# EAGLE design pwm_module (EAGLE 7.6.0)
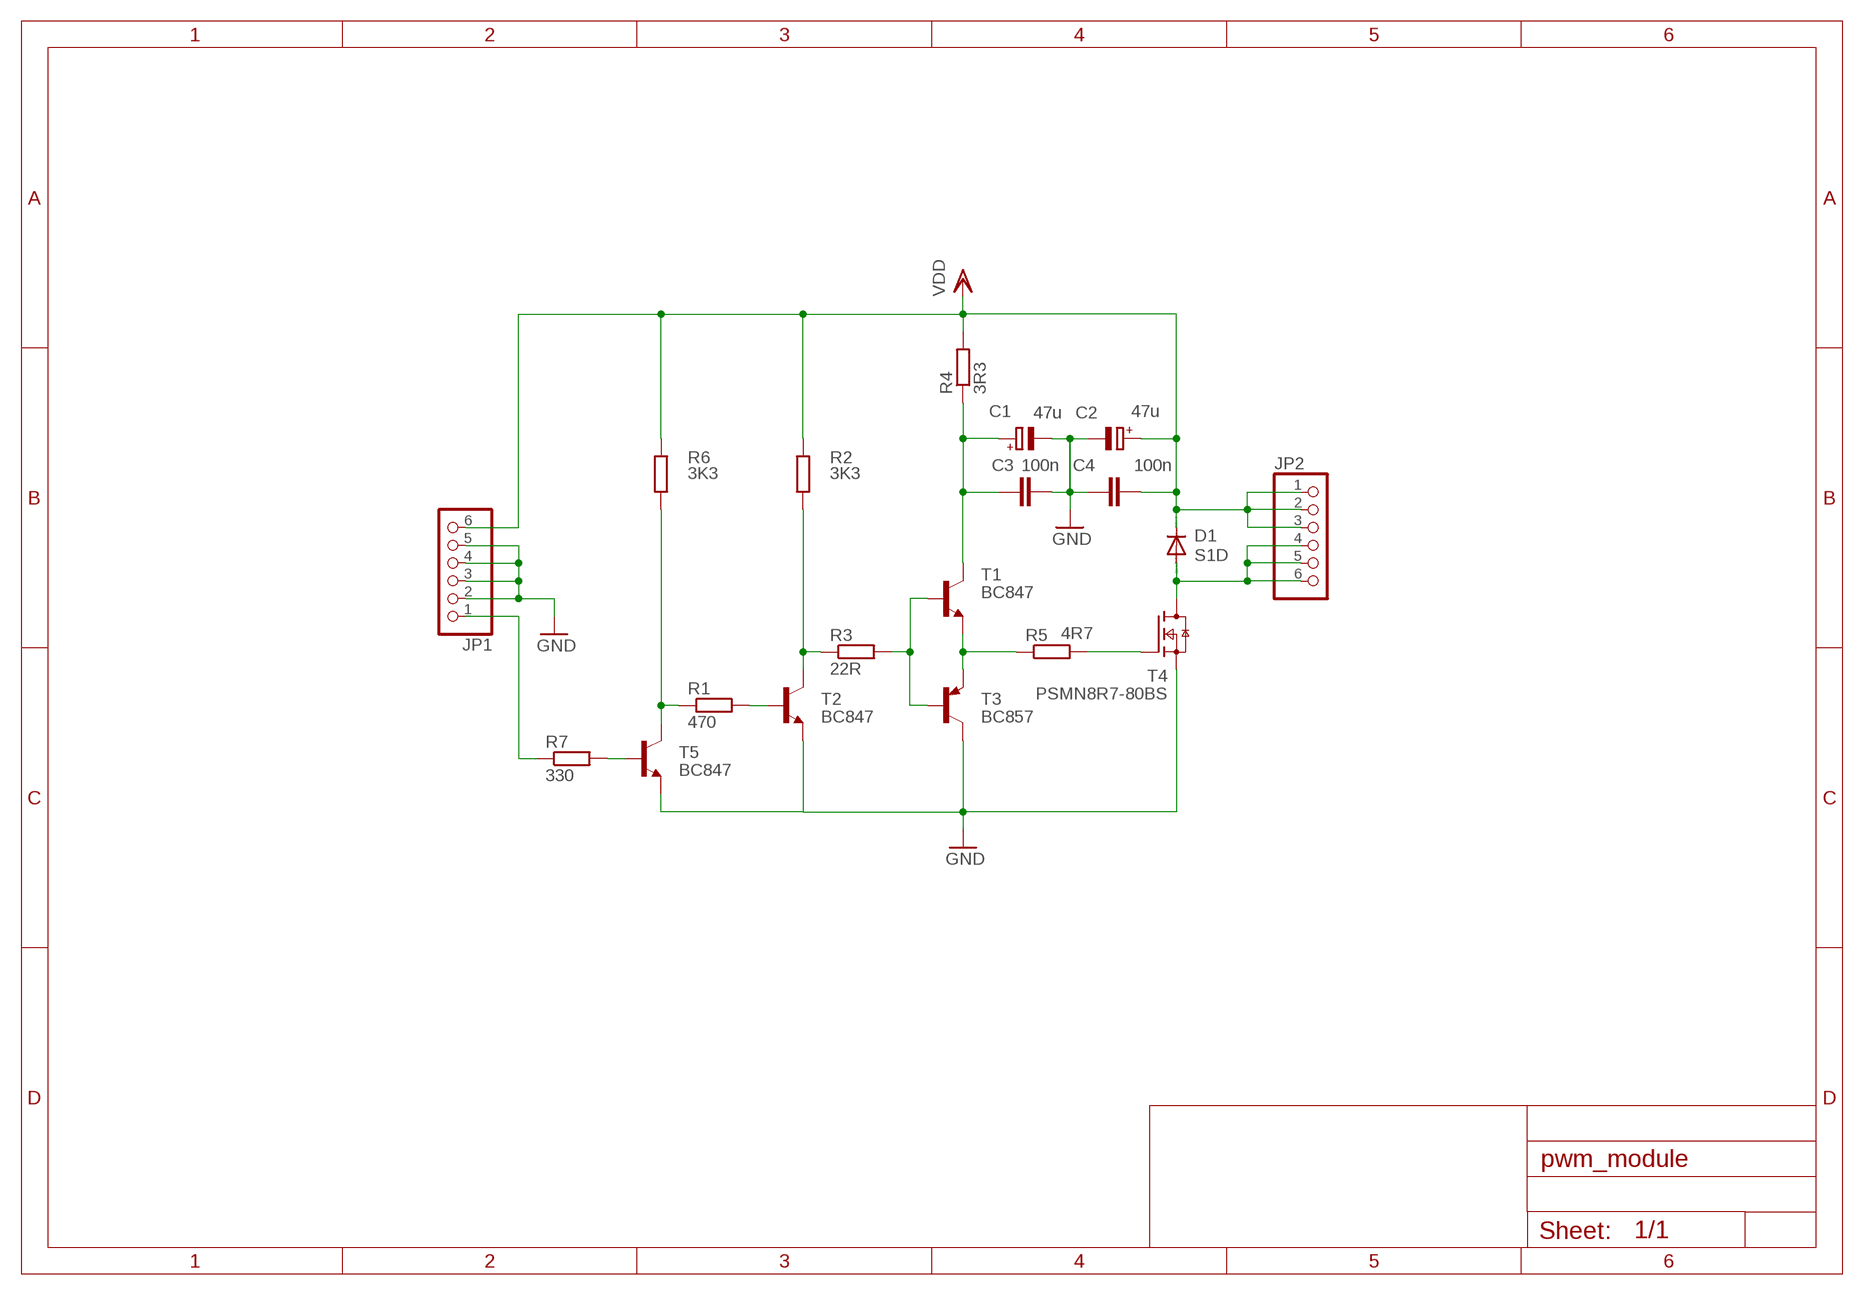
[diagram p0: schematic, sheet 1]

## Parts
C1  47u  CPOL-EUF  [PANASONIC_F]
C2  47u  CPOL-EUF  [PANASONIC_F]
C3  100n  C-EUC1206K  [C1206K]
C4  100n  C-EUC1206K  [C1206K]
D1  S1D  DIODE-DO-214AC  [DO-214AC]
JP1  PINHD-1X6  [1X06]
JP2  PINHD-1X6  [1X06]
R1  470  R-EU_M0805  [M0805]
R2  3K3  R-EU_M0805  [M0805]
R3  22R  R-EU_M0805  [M0805]
R4  3R3  R-EU_M0805  [M0805]
R5  4R7  R-EU_M0805  [M0805]
R6  3K3  R-EU_M0805  [M0805]
R7  330  R-EU_M0805  [M0805]
T1  BC847  [SOT23]
T2  BC847  [SOT23]
T3  BC857  BC857A-PNP-SOT23-BEC  [SOT23-BEC]
T4  PSMN8R7-80BS  BUK761R3-30E  [SOT404]
T5  BC847  [SOT23]

## Nets
GND: C1.- C2.- C3.2 C4.2 JP1.2 JP1.3 JP1.4 JP1.5 T2.2(E) T3.C T4.3(S) T5.2(E)
N$1: R5.1 T1.2(E) T3.E
N$2: R5.2 T4.1(G)
N$3: R3.2 T1.1(B) T3.B
N$4: R2.1 R3.1 T2.3(C)
N$5: R1.2 T2.1(B)
N$6: JP1.1 R7.1
N$7: D1.A JP2.4 JP2.5 JP2.6 T4.MB(D)
N$8: C1.+ C3.1 R4.1 T1.3(C)
N$9: R1.1 R6.1 T5.3(C)
N$10: R7.2 T5.1(B)
V+: C2.+ C4.1 D1.C JP1.6 JP2.1 JP2.2 JP2.3 R2.2 R4.2 R6.2 ; supply symbol labelled VDD

## Library data of the parts
C1 C2 = rcl:CPOL-EU: POLARIZED CAPACITOR, European symbol; FARNELL: 9696032; PRICE: 0.948
C3 C4 = rcl:C-EU: CAPACITOR, European symbol; FARNELL: 1759366; PRICE: 0.0445
D1 = diode:DIODE-: DIODE; FARNELL: 2454091; PRICE: 0.0714
JP1 JP2 = pinhead:PINHD-1X6: PIN HEADER
R1-R7 = rcl:R-EU_: RESISTOR, European symbol
T1 T2 T5 = transistor:BC847: NPN TRANSISTOR; FARNELL: 2432696; PRICE: 0.0329
T3 = transistor:*-PNP-: PNP Transistror; FARNELL: 8734771; PRICE: 0.025
T4 = nxp_60:BUK761R3-30E: N-channel TrenchMOS standard level FET Standard level N-channel MOSFET in a SOT404 package using TrenchMOS technology. This product has been designed and qualified to AEC Q101 standard for use in high performance automotive applications. AAL Eindhoven MK; FARNELL: 2112547; PRICE: 0.59

## Board
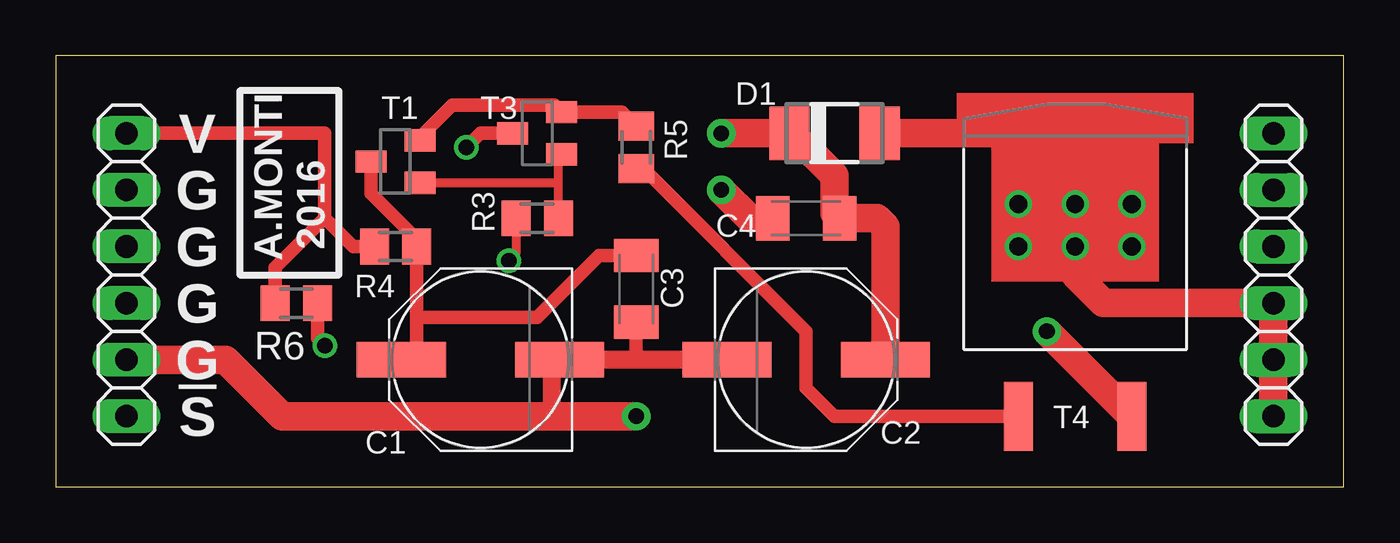
[diagram p1: board, top side]
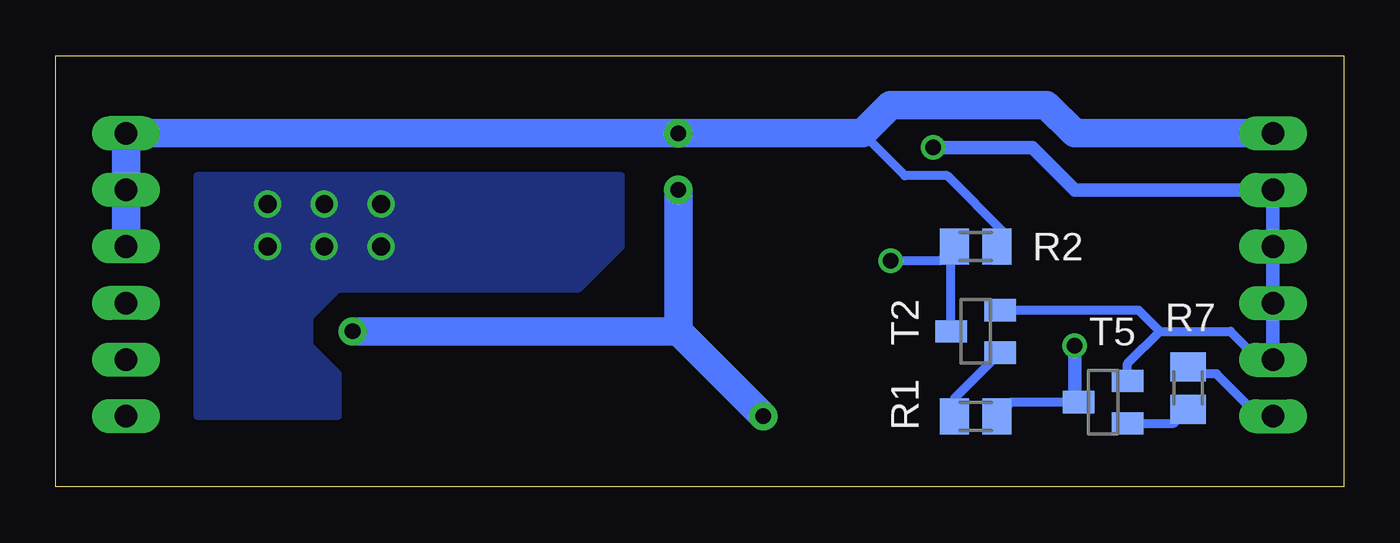
[diagram p2: board, bottom side, seen from below]

Size 57.77 x 19.36 mm. Coordinates in mm from the lower left corner, seen from the top.
Outline: 0,0 57.77,0 57.77,19.36 0,19.36 0,0
Copper layers (1*16): Top 0.035mm / dielectric 1.5mm / Bottom 0.035mm
Design rules "default": minimum track width 10mil, minimum drill 24mil, track to track 8mil, track to pad 8mil, pad to pad 8mil, via to via 8mil, smd to smd 8mil, copper to edge 40mil, drill to drill 8mil, minimum pad ring 10mil, minimum via ring 8mil, stop-mask expansion 4mil, vias tented up to drill 0mil, thermal gap 10mil

### Footprints (pad centres in the part's own frame; a part is rotated, then mirrored left to right if it is on the bottom)
PANASONIC_F = smd 4 x 1.6: + 3.55,0; - -3.55,0
C1206K = smd 1.5 x 2: 1 -1.5,0; 2 1.5,0
DO-214AC = smd 1.8 x 2.4: A 2.025,0; C -2.025,0
1X06 = drill 1.016 long: 1 -6.35,0; 2 -3.81,0; 3 -1.27,0; 4 1.27,0; 5 3.81,0; 6 6.35,0
M0805 = smd 1.3 x 1.6: 1 -0.95,0; 2 0.95,0
SOT23 = smd 1 x 1.4: 1 -0.95,-1.1; 2 0.95,-1.1; 3 0,1.1
SOT23-BEC = smd 1 x 1.4: B -0.95,-1.1; C 0,1.1; E 0.95,-1.1
SOT404 = smd 1.3 x 3.1: 1 -2.54,-6.35; 3 2.54,-6.35 | smd 0 x 0: MB 0,0

### Placement (x,y rotation side)
C1  19.05,5.71 180 top
C2  33.66,5.71 0 top
C3  26.04,8.89 270 top
C4  33.66,12.06 180 top
D1  34.92,15.88 0 top
JP1  3.17,9.53 90 top
JP2  54.61,9.53 270 top
R1  16.51,3.17 180 bottom
R2  16.51,10.79 0 bottom
R3  21.59,12.06 0 top
R4  15.24,10.79 180 top
R5  26.04,15.24 270 top
R6  10.79,8.26 180 top
R7  6.99,4.45 270 bottom
T1  15.24,14.61 90 top
T2  16.51,6.99 90 bottom
T3  21.59,15.88 90 top
T4  45.72,9.53 0 top
T5  10.79,3.81 90 bottom

### Tracks (layer width: path | path; a pad name or v marks a point on that pad's centre or on a via)
GND  (via drill 0.7, 0.7 pad 1.27)
  Top 0.61: T3.C 19.05,15.88 v18.41,15.24 | C1.- 22.23,5.71 | C3.2 26.04,5.71
  Top 0.813: C2.- 26.04,5.71 C1.- | 22.23,5.71 22.23,3.17
  Top 1.27: T4.3 v44.45,6.99 | v26.04,3.17 22.23,3.17 10.16,3.17 7.62,5.71 JP1.2 | C4.2 31.11,12.06 v29.84,13.34
  Bottom 0.406: T5.2 9.7,5.54 8.26,6.99 | 8.26,6.99 5.08,6.99 3.81,5.71 JP1.2 | T2.2 9.21,7.93 8.26,6.99
  Bottom 0.61: JP1.2 JP1.3 JP1.4 JP1.5 12.06,13.34 13.97,15.24 v18.41,15.24
  Bottom 1.27: v44.45,6.99 29.84,6.99 | 29.84,6.99 v26.04,3.17 | v29.84,13.34 29.84,6.99
N$1
  Top 0.61: T1.2 16.34,15.71 17.78,17.14 22.37,17.14 T3.E 25.4,16.82 R5.1
N$2
  Top 0.61: R5.2 26.35,14.29 33.66,6.99 33.66,4.45 34.92,3.17 T4.1
N$3
  Top 0.406: R3.2 22.54,13.65 | 22.54,13.65 22.54,14.78 T3.B | T1.1 22.54,13.65
N$4  (via drill 0.7)
  Top 0.406: R3.1 20.64,10.48 v20.32,10.16
  Bottom 0.406: T2.3 17.61,10.64 R2.1 18.09,10.16 v20.32,10.16
N$5
  Bottom 0.406: R1.2 17.46,3.98 T2.1
N$6
  Bottom 0.406: JP1.1 3.81,3.17 5.71,5.08 6.67,5.08 R7.1
N$7  (via drill 0.8 pad 0.41)
  Top 1.27: JP2.4 JP2.5 JP2.6 JP2.4 | JP2.4 46.99,8.26 T4.MB v45.72,10.79 v45.72,12.7 45.72,15.88 D1.A
  other vias: 43.18,12.7 43.18,10.79 48.26,10.79 48.26,12.7
  pour Bottom (no thermals): 51.44,13.97 51.44,3.17 45.09,3.17 45.09,5.08 46.35,6.35 46.35,7.62 45.09,8.89 34.29,8.89 32.38,10.79 32.38,13.97
N$8
  Top 0.61: 14.14,5.8 C1.+ 16.19,6.41 16.19,7.62 | T1.3 14.14,13.16 16.51,10.79 16.51,10.48 R4.1 16.19,7.62 | C3.1 24.36,10.39 21.59,7.62 16.19,7.62
N$9  (via drill 0.7 pad 0.3)
  Top 0.61: R6.1 11.74,6.67 v12.06,6.35
  Bottom 0.406: T5.3 14.93,3.81 R1.1
  Bottom 0.61: v12.06,6.35 12.06,3.98 T5.3
N$10
  Bottom 0.406: T5.1 7.62,2.86 R7.2
V+  (via drill 0.7 pad 1.27)
  Top 0.61: 12.06,12.06 12.06,15.88 JP1.6 10.79,15.88 | 12.06,12.06 13.34,10.79 R4.2 | R6.2 9.85,9.85 12.06,12.06
  Top 1.27: v29.84,15.88 D1.C 32.9,15.36 33.53,15.36 34.92,13.97 34.92,12.29 C4.1 36.83,12.06 37.2,11.69 C2.+
  Bottom 0.406: R2.2 15.24,11.12 15.24,11.43 17.78,13.97 19.68,13.97 21.59,15.88
  Bottom 1.27: JP2.1 JP2.2 JP2.3 JP2.1 | JP2.1 v29.84,15.88 21.59,15.88 20.32,17.14 13.34,17.14 12.06,15.88 JP1.6

### Text on the board
tNames: V | G | G | A.MONTI / 2016 | G | G | !S